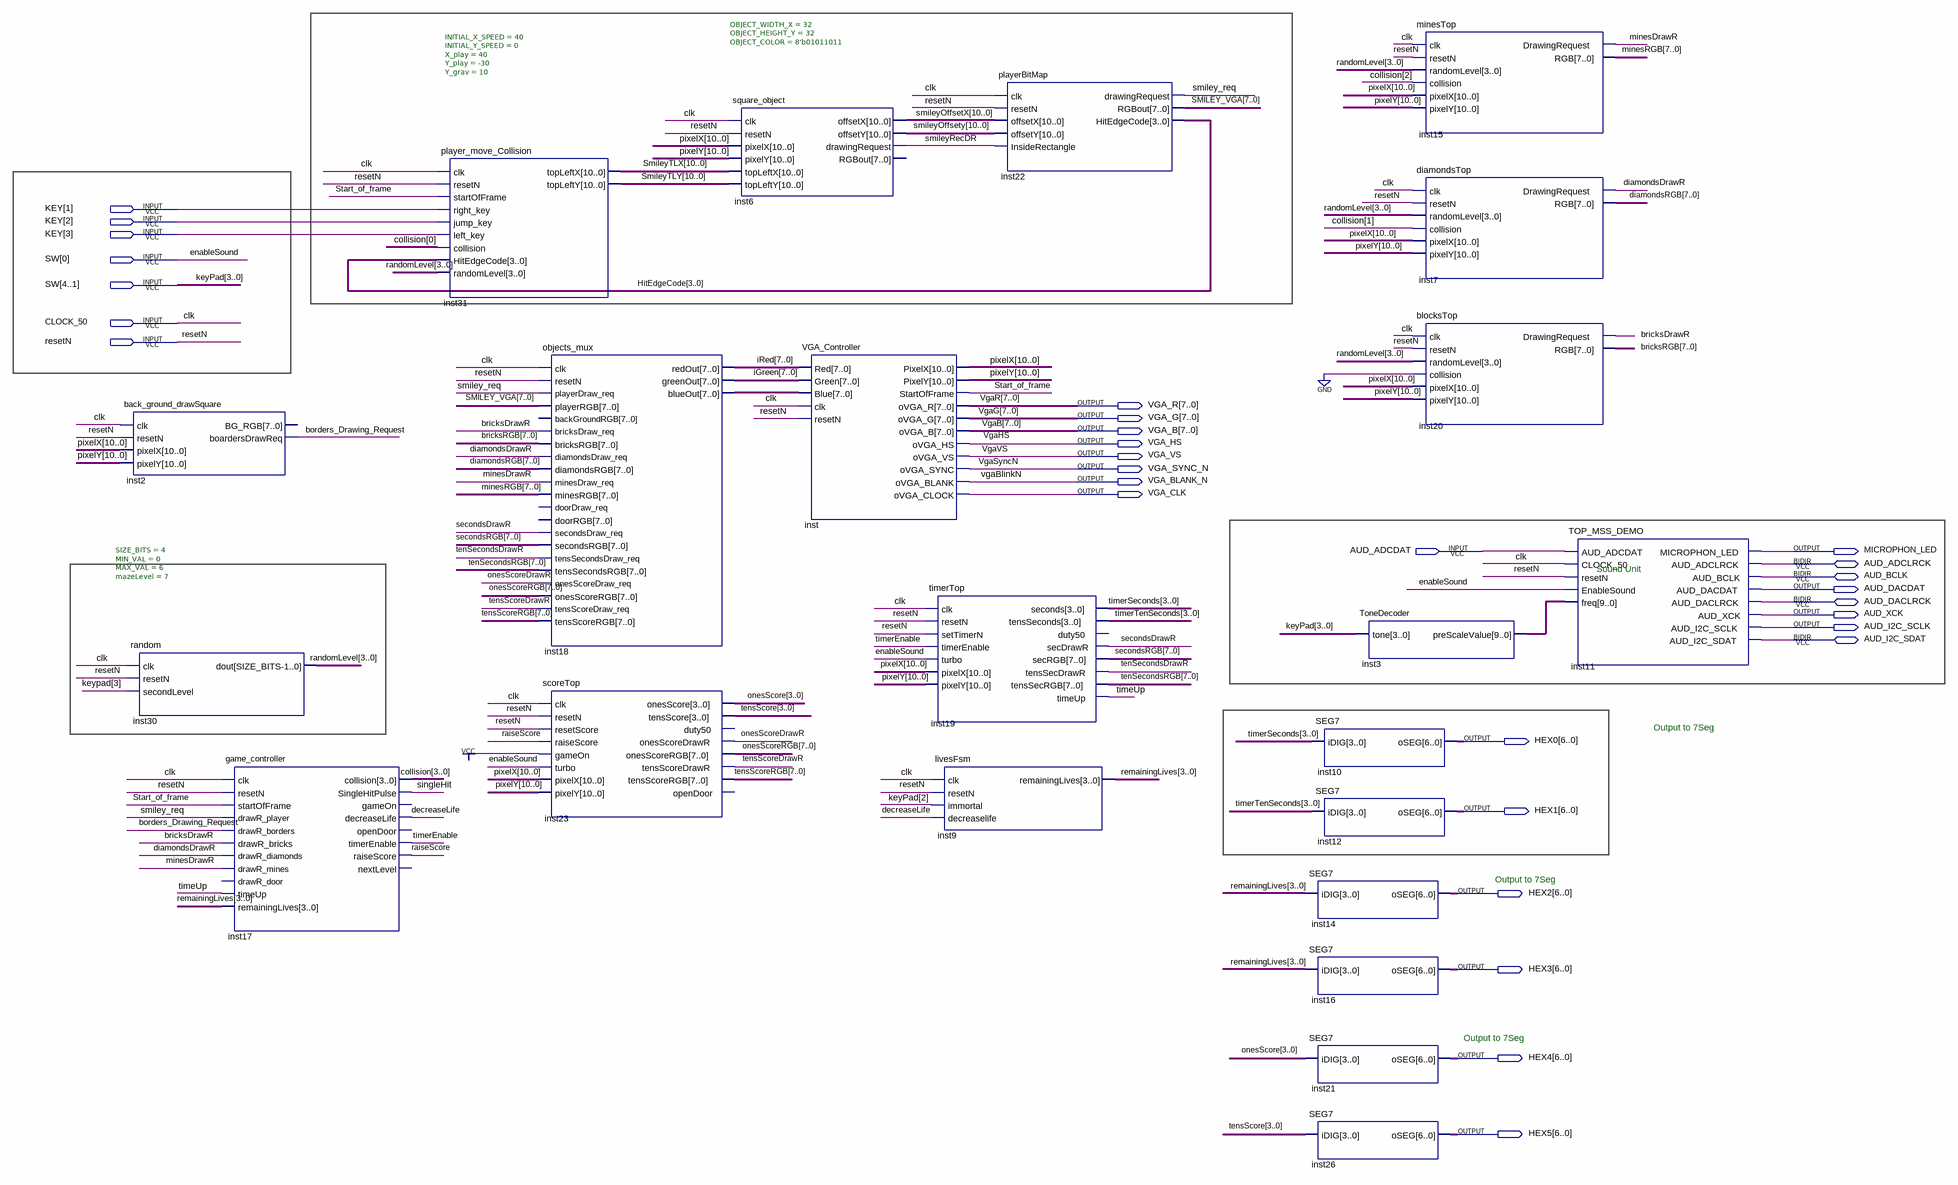
[diagram p0: schematic sheet]
// Quartus schematic TOP_VGA_DEMO_noKBD.bdf as structural Verilog: 22 symbols, 30 pins
module TOP_VGA_DEMO_noKBD (
  input  [3:1] KEY,
  input  [4:0] SW,
  input  CLOCK_50,
  input  resetN,
  input  AUD_ADCDAT,
  inout  AUD_ADCLRCK,
  inout  AUD_BCLK,
  inout  AUD_DACLRCK,
  inout  AUD_I2C_SDAT,
  output [7:0] VGA_R,
  output [7:0] VGA_G,
  output [7:0] VGA_B,
  output VGA_HS,
  output VGA_VS,
  output VGA_SYNC_N,
  output VGA_BLANK_N,
  output VGA_CLK,
  output MICROPHON_LED,
  output AUD_DACDAT,
  output AUD_XCK,
  output AUD_I2C_SCLK,
  output [6:0] HEX0,
  output [6:0] HEX1,
  output [6:0] HEX2,
  output [6:0] HEX3,
  output [6:0] HEX4,
  output [6:0] HEX5
);

  wire borders_Drawing_Request, bricksDrawR, decreaseLife, diamondsDrawR, minesDrawR, onesScoreDrawR,
       raiseScore, secondsDrawR, singleHit, smiley_req, smileyRecDR, Start_of_frame, tenSecondsDrawR,
       tensScoreDrawR, timerEnable, timeUp;
  wire [3:0] collision, HitEdgeCode, onesScore, randomLevel, remainingLives, tensScore, timerSeconds,
       timerTenSeconds;
  wire [7:0] bricksRGB, diamondsRGB, iGreen, inst18_blueout, iRed, minesRGB, onesScoreRGB, secondsRGB,
       SMILEY_VGA, tenSecondsRGB, tensScoreRGB;
  wire [9:0] inst3_prescalevalue;
  wire [10:0] pixelX, pixelY, smileyOffsetX, smileyOffsety, SmileyTLX, SmileyTLY;

  back_ground_drawSquare inst2 (
    .clk(CLOCK_50), .resetN(resetN), .pixelX(pixelX), .pixelY(pixelY),
    .boardersDrawReq(borders_Drawing_Request));  // open: BG_RGB
  random #(.SIZE_BITS(4), .MIN_VAL(0), .MAX_VAL(6), .mazeLevel(7)) inst30 (
    .clk(CLOCK_50), .resetN(resetN), .secondLevel(SW[4]), .dout(randomLevel));
  game_controller inst17 (
    .clk(CLOCK_50), .resetN(resetN), .startOfFrame(Start_of_frame), .drawR_player(smiley_req),
    .drawR_borders(borders_Drawing_Request), .drawR_bricks(bricksDrawR), .drawR_diamonds(diamondsDrawR),
    .drawR_mines(minesDrawR), .timeUp(timeUp), .remainingLives(remainingLives), .collision(collision),
    .SingleHitPulse(singleHit), .decreaseLife(decreaseLife), .timerEnable(timerEnable),
    .raiseScore(raiseScore));  // open: drawR_door, gameOn, openDoor, nextLevel
  player_move_Collision #(.INITIAL_X_SPEED(40), .INITIAL_Y_SPEED(0), .X_play(40), .Y_play(-30), .Y_grav(10)) inst31 (
    .clk(CLOCK_50), .resetN(resetN), .startOfFrame(Start_of_frame), .right_key(KEY[1]), .jump_key(KEY[2]),
    .left_key(KEY[3]), .collision(collision[0]), .HitEdgeCode(HitEdgeCode), .randomLevel(randomLevel),
    .topLeftX(SmileyTLX), .topLeftY(SmileyTLY));
  objects_mux inst18 (
    .clk(CLOCK_50), .resetN(resetN), .playerDraw_req(smiley_req), .playerRGB(SMILEY_VGA),
    .bricksDraw_req(bricksDrawR), .bricksRGB(bricksRGB), .diamondsDraw_req(diamondsDrawR),
    .diamondsRGB(diamondsRGB), .minesDraw_req(minesDrawR), .minesRGB(minesRGB),
    .secondsDraw_req(secondsDrawR), .secondsRGB(secondsRGB), .tensSecondsDraw_req(tenSecondsDrawR),
    .tensSecondsRGB(tenSecondsRGB), .onesScoreDraw_req(onesScoreDrawR), .onesScoreRGB(onesScoreRGB),
    .tensScoreDraw_req(tensScoreDrawR), .tensScoreRGB(tensScoreRGB), .redOut(iRed), .greenOut(iGreen),
    .blueOut(inst18_blueout));  // open: backGroundRGB, doorDraw_req, doorRGB
  scoreTop inst23 (
    .clk(CLOCK_50), .resetN(resetN), .resetScore(resetN), .raiseScore(raiseScore), .gameOn(1'b1),
    .turbo(SW[0]), .pixelX(pixelX), .pixelY(pixelY), .onesScore(onesScore), .tensScore(tensScore),
    .onesScoreDrawR(onesScoreDrawR), .onesScoreRGB(onesScoreRGB), .tensScoreDrawR(tensScoreDrawR),
    .tensScoreRGB(tensScoreRGB));  // open: duty50, openDoor
  square_object #(.OBJECT_WIDTH_X(32), .OBJECT_HEIGHT_Y(32), .OBJECT_COLOR(8'b01011011)) inst6 (
    .clk(CLOCK_50), .resetN(resetN), .pixelX(pixelX), .pixelY(pixelY), .topLeftX(SmileyTLX),
    .topLeftY(SmileyTLY), .offsetX(smileyOffsetX), .offsetY(smileyOffsety), .drawingRequest(smileyRecDR));  // open: RGBout
  VGA_Controller inst (
    .Red(iRed), .Green(iGreen), .Blue(inst18_blueout), .clk(CLOCK_50), .resetN(resetN), .PixelX(pixelX),
    .PixelY(pixelY), .StartOfFrame(Start_of_frame), .oVGA_R(VGA_R), .oVGA_G(VGA_G), .oVGA_B(VGA_B),
    .oVGA_HS(VGA_HS), .oVGA_VS(VGA_VS), .oVGA_SYNC(VGA_SYNC_N), .oVGA_BLANK(VGA_BLANK_N), .oVGA_CLOCK(VGA_CLK));
  timerTop inst19 (
    .clk(CLOCK_50), .resetN(resetN), .setTimerN(resetN), .timerEnable(timerEnable), .turbo(SW[0]),
    .pixelX(pixelX), .pixelY(pixelY), .seconds(timerSeconds), .tensSeconds(timerTenSeconds),
    .secDrawR(secondsDrawR), .secRGB(secondsRGB), .tensSecDrawR(tenSecondsDrawR), .tensSecRGB(tenSecondsRGB),
    .timeUp(timeUp));  // open: duty50
  livesFsm inst9 (
    .clk(CLOCK_50), .resetN(resetN), .immortal(SW[3]), .decreaselife(decreaseLife),
    .remainingLives(remainingLives));
  playerBitMap inst22 (
    .clk(CLOCK_50), .resetN(resetN), .offsetX(smileyOffsetX), .offsetY(smileyOffsety),
    .InsideRectangle(smileyRecDR), .drawingRequest(smiley_req), .RGBout(SMILEY_VGA), .HitEdgeCode(HitEdgeCode));
  SEG7 inst10 (.iDIG(timerSeconds), .oSEG(HEX0));
  SEG7 inst12 (.iDIG(timerTenSeconds), .oSEG(HEX1));
  SEG7 inst14 (.iDIG(remainingLives), .oSEG(HEX2));
  SEG7 inst16 (.iDIG(remainingLives), .oSEG(HEX3));
  SEG7 inst21 (.iDIG(onesScore), .oSEG(HEX4));
  SEG7 inst26 (.iDIG(tensScore), .oSEG(HEX5));
  ToneDecoder inst3 (.tone(SW[4:1]), .preScaleValue(inst3_prescalevalue));
  minesTop inst15 (
    .clk(CLOCK_50), .resetN(resetN), .randomLevel(randomLevel), .collision(collision[2]), .pixelX(pixelX),
    .pixelY(pixelY), .DrawingRequest(minesDrawR), .RGB(minesRGB));
  diamondsTop inst7 (
    .clk(CLOCK_50), .resetN(resetN), .randomLevel(randomLevel), .collision(collision[1]), .pixelX(pixelX),
    .pixelY(pixelY), .DrawingRequest(diamondsDrawR), .RGB(diamondsRGB));
  blocksTop inst20 (
    .clk(CLOCK_50), .resetN(resetN), .randomLevel(randomLevel), .collision(1'b0), .pixelX(pixelX),
    .pixelY(pixelY), .DrawingRequest(bricksDrawR), .RGB(bricksRGB));
  TOP_MSS_DEMO inst11 (
    .AUD_ADCDAT(AUD_ADCDAT), .CLOCK_50(CLOCK_50), .resetN(resetN), .EnableSound(SW[0]),
    .freq(inst3_prescalevalue), .MICROPHON_LED(MICROPHON_LED), .AUD_DACDAT(AUD_DACDAT), .AUD_XCK(AUD_XCK),
    .AUD_I2C_SCLK(AUD_I2C_SCLK), .AUD_ADCLRCK(AUD_ADCLRCK), .AUD_BCLK(AUD_BCLK), .AUD_DACLRCK(AUD_DACLRCK),
    .AUD_I2C_SDAT(AUD_I2C_SDAT));

  // Other names for the same wires on the sheet: clk = CLOCK_50; enableSound = SW[0]; keyPad[3:0] = SW[4:1];
  //   VgaB[7:0] = VGA_B; vgaBlinkN = VGA_BLANK_N; VgaG[7:0] = VGA_G; VgaHS = VGA_HS; VgaR[7:0] = VGA_R;
  //   VgaSyncN = VGA_SYNC_N; VgaVS = VGA_VS

  // Notes on the sheet:
  //   Sound Unit
  //   Output to 7Seg
  //   Output to 7Seg
  //   Output to 7Seg
endmodule
